# Altium project Shuttler_AMC.PrjPcb (part 18 of 20)

## Sheet FPGA_Decoupling.SchDoc: =ProjectName
size 420 x 297 mm; Author: T.P.; CompanyName: WUT; DrawnBy: T.P.; Organization: WUT ISE; Address1: Warsaw Univeristy of Technology; Address2: Nowowiejska 15/19; DocumentNumber: 12; Revision: 0.9; SheetNumber: 12; SheetTotal: 36; EDA_Number: ARTIQ; Projet: ARTIQ/SINARA; ModifiedBy: -; CreateDate: XX/XX/XXXX; CheckedDate: -; Title2: FPGA_Decoupling.SchDoc; DivGrp: ISE; Designer: G.K. and T.P.; ModifiedDate: -; ProjectName: ADC/DAC MEZZANINE
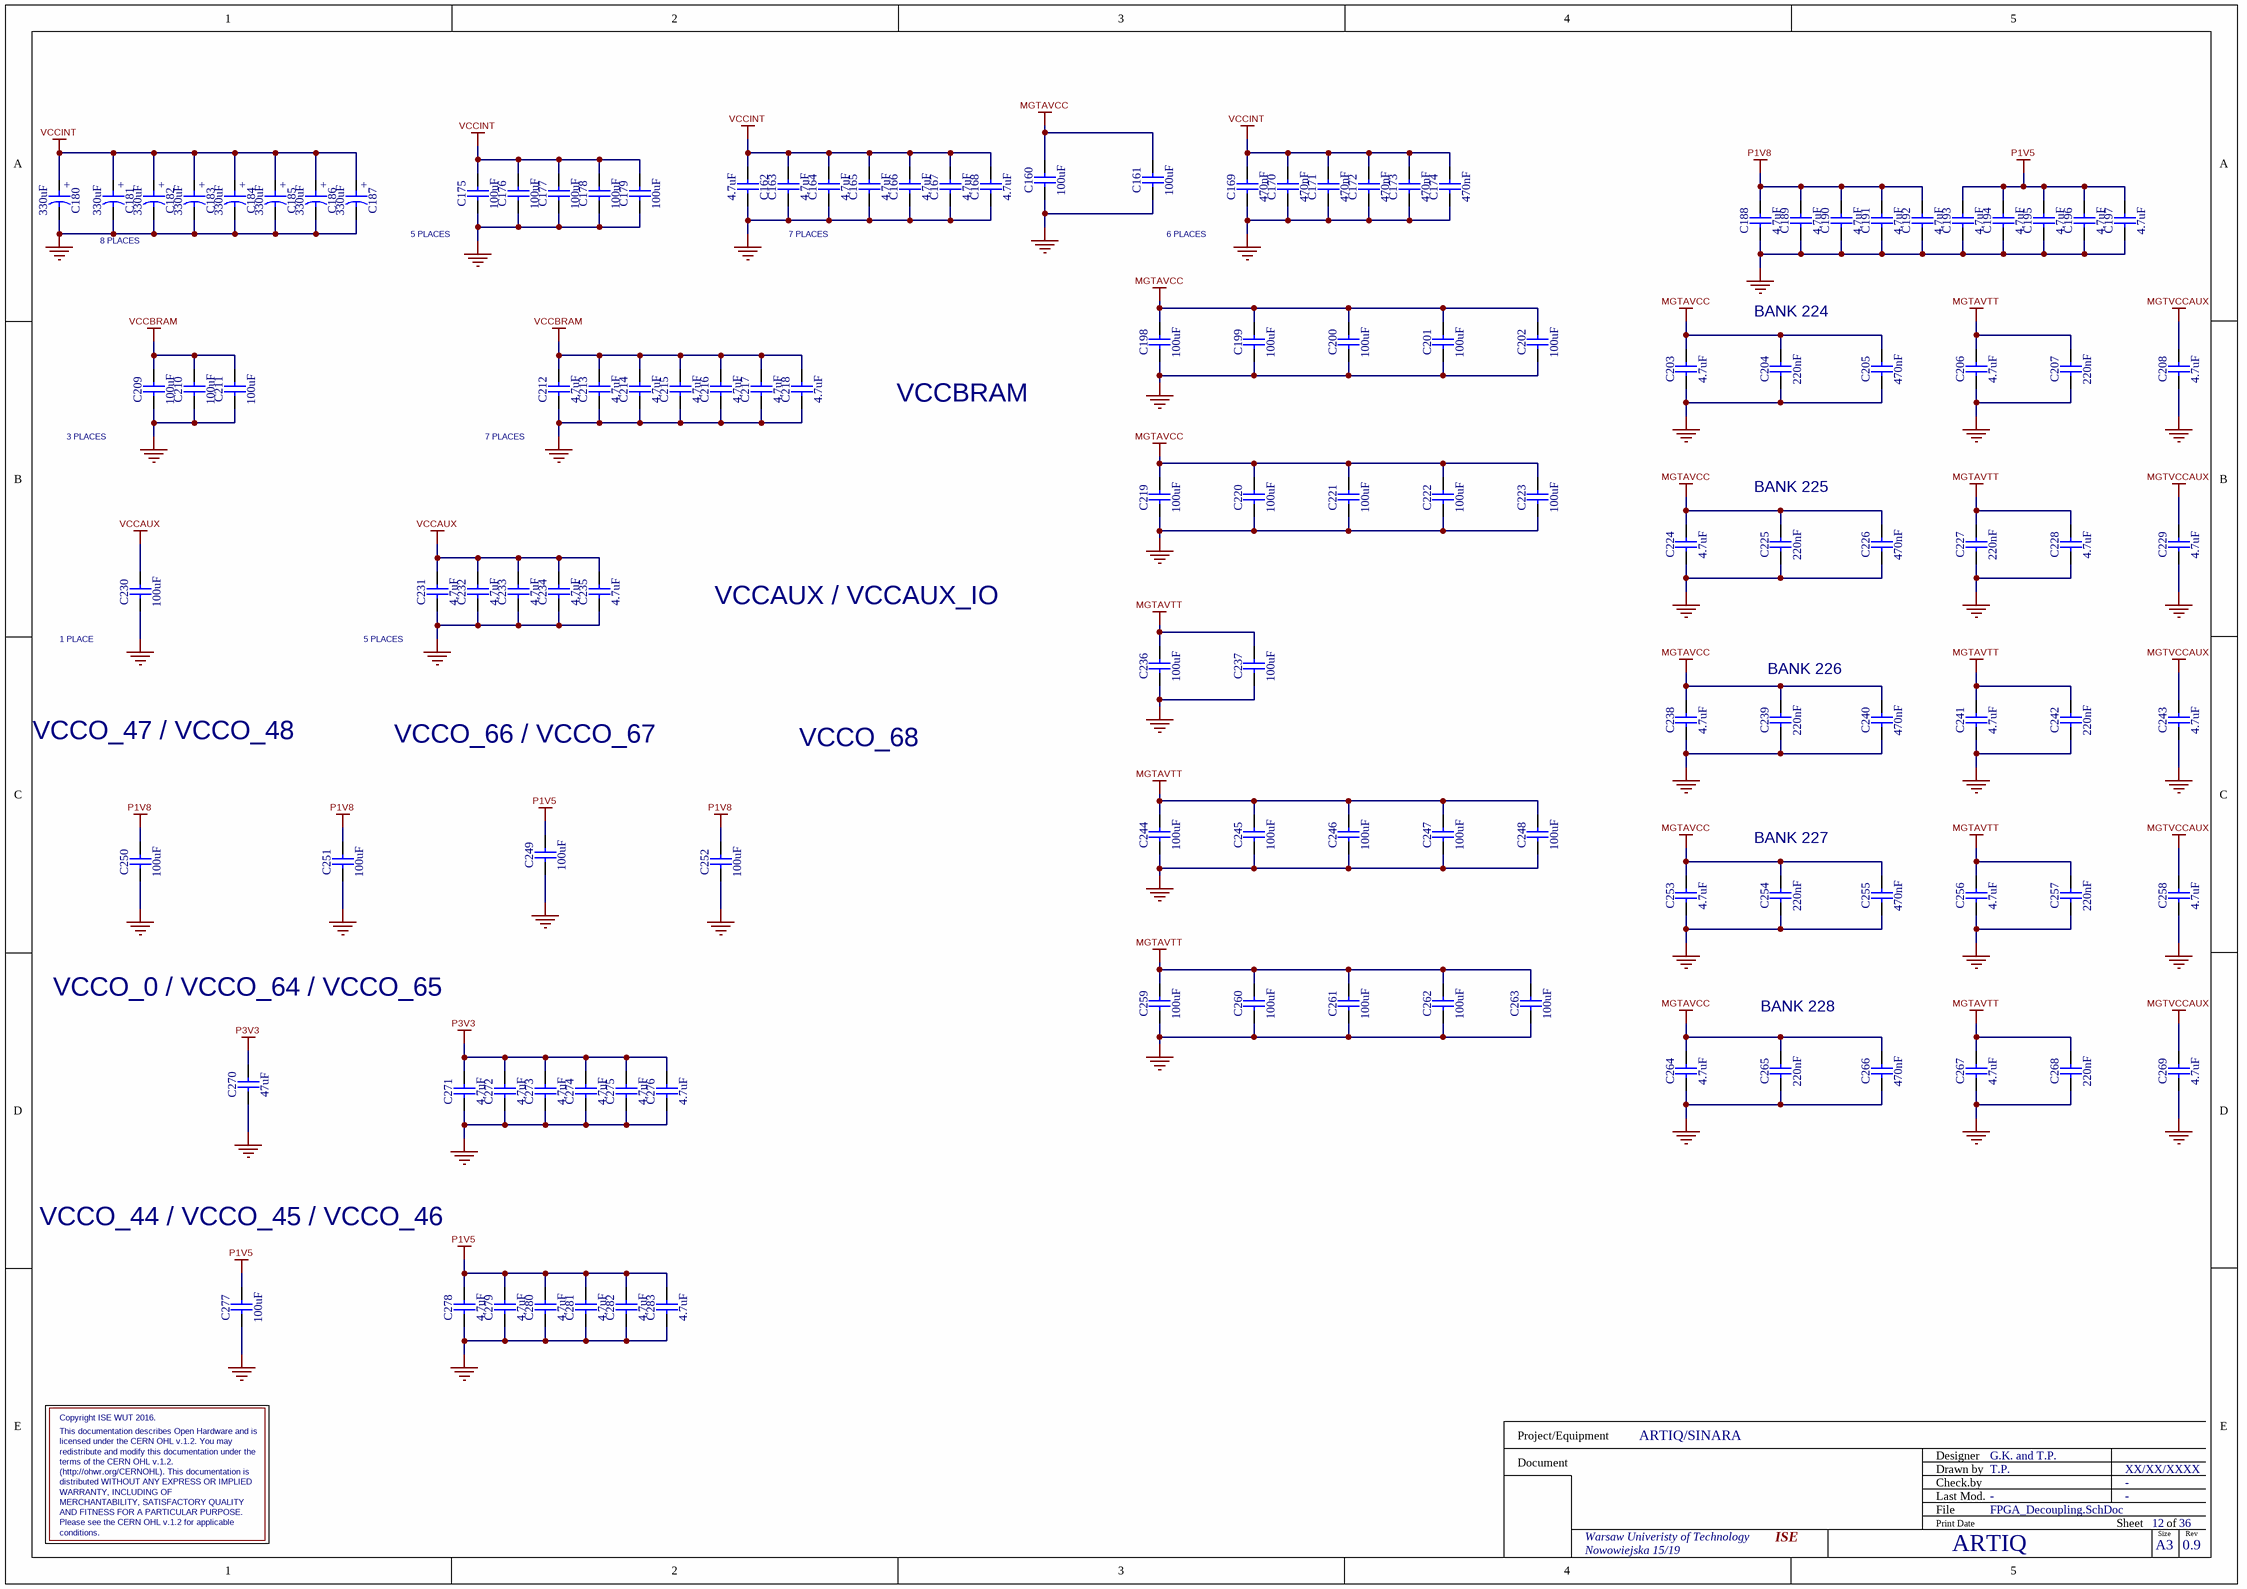
[diagram p36: FPGA_Decoupling.SchDoc]

### Parts
C160  100uF  [CAPC3216X180N]
C161  100uF  [CAPC3216X180N]
C162  4.7uF  [CAPC1005X55N]
C163  4.7uF  [CAPC1005X55N]
C164  4.7uF  [CAPC1005X55N]
C165  4.7uF  [CAPC1005X55N]
C166  4.7uF  [CAPC1005X55N]
C167  4.7uF  [CAPC1005X55N]
C168  4.7uF  [CAPC1005X55N]
C169  470nF  [CAPC0603X33N]
C170  470nF  [CAPC0603X33N]
C171  470nF  [CAPC0603X33N]
C172  470nF  [CAPC0603X33N]
C173  470nF  [CAPC0603X33N]
C174  470nF  [CAPC0603X33N]
C175  100uF  [CAPC3216X180N]
C176  100uF  [CAPC3216X180N]
C177  100uF  [CAPC3216X180N]
C178  100uF  [CAPC3216X180N]
C179  100uF  [CAPC3216X180N]
C180  330uF  [CAPMP3528X210N]
C181  330uF  [CAPMP3528X210N]
C182  330uF  [CAPMP3528X210N]
C183  330uF  [CAPMP3528X210N]
C184  330uF  [CAPMP3528X210N]
C185  330uF  [CAPMP3528X210N]
C186  330uF  [CAPMP3528X210N]
C187  330uF  [CAPMP3528X210N]
C188  4.7uF  [CAPC1005X55N]
C189  4.7uF  [CAPC1005X55N]
C190  4.7uF  [CAPC1005X55N]
C191  4.7uF  [CAPC1005X55N]
C192  4.7uF  [CAPC1005X55N]
C193  4.7uF  [CAPC1005X55N]
C194  4.7uF  [CAPC1005X55N]
C195  4.7uF  [CAPC1005X55N]
C196  4.7uF  [CAPC1005X55N]
C197  4.7uF  [CAPC1005X55N]
C198  100uF  [CAPC3216X180N]
C199  100uF  [CAPC3216X180N]
C200  100uF  [CAPC3216X180N]
C201  100uF  [CAPC3216X180N]
C202  100uF  [CAPC3216X180N]
C203  4.7uF  [CAPC1005X55N]
C204  220nF  [CAPC0603X33N]
C205  470nF  [CAPC0603X33N]
C206  4.7uF  [CAPC1005X55N]
C207  220nF  [CAPC0603X33N]
C208  4.7uF  [CAPC1005X55N]
C209  100uF  [CAPC3216X180N]
C210  100uF  [CAPC3216X180N]
C211  100uF  [CAPC3216X180N]
C212  4.7uF  [CAPC1005X55N]
C213  4.7uF  [CAPC1005X55N]
C214  4.7uF  [CAPC1005X55N]
C215  4.7uF  [CAPC1005X55N]
C216  4.7uF  [CAPC1005X55N]
C217  4.7uF  [CAPC1005X55N]
C218  4.7uF  [CAPC1005X55N]
C219  100uF  [CAPC3216X180N]
C220  100uF  [CAPC3216X180N]
C221  100uF  [CAPC3216X180N]
C222  100uF  [CAPC3216X180N]
C223  100uF  [CAPC3216X180N]
C224  4.7uF  [CAPC1005X55N]
C225  220nF  [CAPC0603X33N]
C226  470nF  [CAPC0603X33N]
C227  220nF  [CAPC0603X33N]
C228  4.7uF  [CAPC1005X55N]
C229  4.7uF  [CAPC1005X55N]
C230  100uF  [CAPC3216X180N]
C231  4.7uF  [CAPC1005X55N]
C232  4.7uF  [CAPC1005X55N]
C233  4.7uF  [CAPC1005X55N]
C234  4.7uF  [CAPC1005X55N]
C235  4.7uF  [CAPC1005X55N]
C236  100uF  [CAPC3216X180N]
C237  100uF  [CAPC3216X180N]
C238  4.7uF  [CAPC1005X55N]
C239  220nF  [CAPC0603X33N]
C240  470nF  [CAPC0603X33N]
C241  4.7uF  [CAPC1005X55N]
C242  220nF  [CAPC0603X33N]
C243  4.7uF  [CAPC1005X55N]
C244  100uF  [CAPC3216X180N]
C245  100uF  [CAPC3216X180N]
C246  100uF  [CAPC3216X180N]
C247  100uF  [CAPC3216X180N]
C248  100uF  [CAPC3216X180N]
C249  100uF  [CAPC3216X180N]
C250  100uF  [CAPC3216X180N]
C251  100uF  [CAPC3216X180N]
C252  100uF  [CAPC3216X180N]
C253  4.7uF  [CAPC1005X55N]
C254  220nF  [CAPC0603X33N]
C255  470nF  [CAPC0603X33N]
C256  4.7uF  [CAPC1005X55N]
C257  220nF  [CAPC0603X33N]
C258  4.7uF  [CAPC1005X55N]
C259  100uF  [CAPC3216X180N]
C260  100uF  [CAPC3216X180N]
C261  100uF  [CAPC3216X180N]
C262  100uF  [CAPC3216X180N]
C263  100uF  [CAPC3216X180N]
C264  4.7uF  [CAPC1005X55N]
C265  220nF  [CAPC0603X33N]
C266  470nF  [CAPC0603X33N]
C267  4.7uF  [CAPC1005X55N]
C268  220nF  [CAPC0603X33N]
C269  4.7uF  [CAPC1005X55N]
C270  47uF  [CAPC3225X270N]
C271  4.7uF  [CAPC1005X55N]
C272  4.7uF  [CAPC1005X55N]
C273  4.7uF  [CAPC1005X55N]
C274  4.7uF  [CAPC1005X55N]
C275  4.7uF  [CAPC1005X55N]
C276  4.7uF  [CAPC1005X55N]
C277  100uF  [CAPC3216X180N]
C278  4.7uF  [CAPC1005X55N]
C279  4.7uF  [CAPC1005X55N]
C280  4.7uF  [CAPC1005X55N]
C281  4.7uF  [CAPC1005X55N]
C282  4.7uF  [CAPC1005X55N]
C283  4.7uF  [CAPC1005X55N]

### Nets
GND: C160.1 C161.1 C162.1 C163.1 C164.1 C165.1 C166.1 C167.1 C168.1 C169.1 C170.1 C171.1 C172.1 C173.1 C174.1 C175.1 C176.1 C177.1 C178.1 C179.1 C180.2 C181.2 C182.2 C183.2 C184.2 C185.2 C186.2 C187.2 C188.1 C189.1 C190.1 C191.1 C192.1 C193.1 C194.1 C195.1 C196.1 C197.1 C198.1 C199.1 C200.1 C201.1 C202.1 C203.1 C204.1 C205.1 C206.1 C207.1 C208.1 C209.1 C210.1 C211.1 C212.1 C213.1 C214.1 C215.1 C216.1 C217.1 C218.1 C219.1 C220.1 C221.1 C222.1 C223.1 C224.1 C225.1 C226.1 C227.1 C228.1 C229.1 C230.1 C231.1 C232.1 C233.1 C234.1 C235.1 C236.1 C237.1 C238.1 C239.1 C240.1 C241.1 C242.1 C243.1 C244.1 C245.1 C246.1 C247.1 C248.1 C249.1 C250.1 C251.1 C252.1 C253.1 C254.1 C255.1 C256.1 C257.1 C258.1 C259.1 C260.1 C261.1 C262.1 C263.1 C264.1 C265.1 C266.1 C267.1 C268.1 C269.1 C270.1 C271.1 C272.1 C273.1 C274.1 C275.1 C276.1 C277.1 C278.1 C279.1 C280.1 C281.1 C282.1 C283.1
MGTAVCC: C160.2 C161.2 C198.2 C199.2 C200.2 C201.2 C202.2 C203.2 C204.2 C205.2 C219.2 C220.2 C221.2 C222.2 C223.2 C224.2 C225.2 C226.2 C238.2 C239.2 C240.2 C253.2 C254.2 C255.2 C264.2 C265.2 C266.2
MGTAVTT: C206.2 C207.2 C227.2 C228.2 C236.2 C237.2 C241.2 C242.2 C244.2 C245.2 C246.2 C247.2 C248.2 C256.2 C257.2 C259.2 C260.2 C261.2 C262.2 C263.2 C267.2 C268.2
MGTVCCAUX: C208.2 C229.2 C243.2 C258.2 C269.2
P1V5: C193.2 C194.2 C195.2 C196.2 C197.2 C249.2 C277.2 C278.2 C279.2 C280.2 C281.2 C282.2 C283.2
P1V8: C188.2 C189.2 C190.2 C191.2 C192.2 C250.2 C251.2 C252.2
P3V3: C270.2 C271.2 C272.2 C273.2 C274.2 C275.2 C276.2
VCCAUX: C230.2 C231.2 C232.2 C233.2 C234.2 C235.2
VCCBRAM: C209.2 C210.2 C211.2 C212.2 C213.2 C214.2 C215.2 C216.2 C217.2 C218.2
VCCINT: C162.2 C163.2 C164.2 C165.2 C166.2 C167.2 C168.2 C169.2 C170.2 C171.2 C172.2 C173.2 C174.2 C175.2 C176.2 C177.2 C178.2 C179.2 C180.1 C181.1 C182.1 C183.1 C184.1 C185.1 C186.1 C187.1

### Notes on the sheet
- 8 PLACES
- 5 PLACES
- 7 PLACES
- 6 PLACES
- (near C204) BANK 224
- 3 PLACES
- VCCBRAM
- (near C225) BANK 225
- 1 PLACE
- VCCAUX / VCCAUX_IO
- (near C239) BANK 226
- VCCO_47 / VCCO_48
- VCCO_66 / VCCO_67
- VCCO_68
- (near C254) BANK 227
- VCCO_0 / VCCO_64 / VCCO_65
- (near C265) BANK 228
- VCCO_44 / VCCO_45 / VCCO_46
- Copyright ISE WUT 2016.
- terms of the CERN OHL v.1.2.
- (http://ohwr.org/CERNOHL). This documentation is
- licensed under the CERN OHL v.1.2. You may
- redistribute and modify this documentation under the
- This documentation describes Open Hardware and is
- distributed WITHOUT ANY EXPRESS OR IMPLIED
- conditions.
- AND FITNESS FOR A PARTICULAR PURPOSE.
- Please see the CERN OHL v.1.2 for applicable
- WARRANTY, INCLUDING OF
- MERCHANTABILITY, SATISFACTORY QUALITY
- Project/Equipment
- Document
- Designer
- Drawn by
- Check.by
- File
- Last Mod.
- Print Date
- Sheet
- Size
- A3
- of
- Rev
- (in symbol CTE3528-21_330UF_2.5V_20%_LESR0015_KEMET_T520) +

### Library data of the parts
C160 C161 C175-C179 C198-C202 C209-C211 C219-C223 C230 C236 C237 C244-C252 C259-C263 C277 = CC1206_100UF_6.3V_20%_X5R: Non-polarised capacitor; Manufacturer: GENERIC; Part Description: SMD Multilayer Chip Ceramic Capacitor; Manufacturer1 Part Number: C1206C107M9PACTU; Tolerance: ±10%; Voltage: 6.3V; TC: X5R; Manufacturer Part Number: CC1206_100UF_6.3V_20%_X5R; Part Number: CC1206_100UF_6.3V_20%_X5R; Value: 100uF; Component Kind: Standard; Component Type: Standard; Pin Count: 2; Status: None; Case: 1206; Mounted: Yes; Socket: No; SMD: Yes; Sense: No; Manufacturer1 Example: KEMET; Manufacturer1 ComponentHeight: 1.8mm; HelpURL: \\cern.ch\dfs\Applications\Altium\Datasheets\CC1206_X5R_KEMET.pdf; Author: CERN DEM JLC; CreateDate: 26.09.2012; LatestRevisionDate: 26.09.2012
C162-C168 C188-C197 C203 C206 C208 C212-C218 C224 C228 C229 C231-C235 C238 C241 C243 C253 C256 C258 C264 C267 C269 C271-C276 C278-C283 = CC0402_4.7UF_6.3V_20%_X5R: Non-polarised capacitor; Manufacturer: GENERIC; Part Description: SMD Multilayer Chip Ceramic Capacitor; Manufacturer1 Part Number: C1005X5R0J475M050BC; Tolerance: ±20%; Voltage: 6.3V; TC: X5R; Manufacturer Part Number: CC0402_4.7UF_6.3V_20%_X5R; Part Number: CC0402_4.7UF_6.3V_20%_X5R; Value: 4.7uF; Component Kind: Standard; Component Type: Standard; Pin Count: 2; Status: Preferred; Case: 0402; Mounted: Yes; Socket: No; SMD: Yes; Sense: No; Manufacturer1 Example: TDK; Manufacturer1 ComponentHeight: 0.65mm; HelpURL: \\cern.ch\dfs\Applications\Altium\Datasheets\CC0402_X5R_TDK_C.pdf; Author: CERN DEM JLC; CreateDate: 03.03.2015; LatestRevisionDate: 03.03.2015
C169-C174 C205 C226 C240 C255 C266 = CC0201_470NF_4V_20%_X5R: Non-polarised capacitor; Manufacturer: GENERIC; Part Description: SMD Multilayer Chip Ceramic Capacitor; Manufacturer1 Part Number: AMK063BJ474MP-F; Tolerance: ±20%; Voltage: 4V; TC: X5R; Manufacturer Part Number: CC0201_470NF_4V_20%_X5R; Part Number: CC0201_470NF_4V_20%_X5R; Value: 470nF; Component Kind: Standard; Component Type: Standard; Pin Count: 2; Status: Not Recommended; Case: 0201; Mounted: Yes; Socket: No; SMD: Yes; Sense: No; Manufacturer1 Example: TAIYO YUDEN; Manufacturer1 ComponentHeight: 0.33mm; HelpURL: \\cern.ch\dfs\Applications\Altium\Datasheets\CC0201_X5R_TAIYO-YUDEN_STANDARD-CLASS2.pdf; Author: CERN DEM JLC; CreateDate: 27.05.2010; LatestRevisionDate: 27.05.2010
C180-C187 = CTE3528-21_330UF_2.5V_20%_LESR0015_KEMET_T520: Polarised capacitor; Manufacturer Part Number: T520B337M2R5ATE015; Manufacturer: KEMET; Part Description: Low ESR 0R015 Tantalum Chip Capacitor; Tolerance: ±20%; Voltage: 2.5V; Part Number: CTE3528-21_330UF_2.5V_20%_LESR0015_KEMET_T520; Value: 330uF; Component Kind: Standard; Component Type: Standard; Pin Count: 2; Status: None; Case: B; Mounted: Yes; Socket: No; SMD: Yes; Sense: No; ComponentHeight: 2.1mm; HelpURL: \\cern.ch\dfs\Applications\Altium\Datasheets\CTE-LESR_KEMET_T520.pdf; Author: CERN DEM JLC; CreateDate: 07.03.2012; LatestRevisionDate: 01.09.2014
C204 C207 C225 C227 C239 C242 C254 C257 C265 C268 = CC0201_220NF_6.3V_20%_X5R: Non-polarised capacitor; Manufacturer: GENERIC; Part Description: SMD Multilayer Chip Ceramic Capacitor; Manufacturer1 Part Number: JMK063BJ224MP-F; Tolerance: ±20%; Voltage: 6.3V; TC: X5R; Manufacturer Part Number: CC0201_220NF_6.3V_20%_X5R; Part Number: CC0201_220NF_6.3V_20%_X5R; Value: 220nF; Component Kind: Standard; Component Type: Standard; Pin Count: 2; Status: Not Recommended; Case: 0201; Mounted: Yes; Socket: No; SMD: Yes; Sense: No; Manufacturer1 Example: TAIYO YUDEN; Manufacturer1 ComponentHeight: 0.33mm; HelpURL: \\cern.ch\dfs\Applications\Altium\Datasheets\CC0201_X5R_TAIYO-YUDEN_STANDARD-CLASS2.pdf; Author: CERN DEM JLC; CreateDate: 27.05.2010; LatestRevisionDate: 27.05.2010
C270 = CC1210_47UF_6.3V_10%_X5R: Non-polarised capacitor; Manufacturer: GENERIC; Part Description: SMD Multilayer Chip Ceramic Capacitor; Manufacturer1 Part Number: 12106D476KAT2A; Tolerance: ±10%; Voltage: 6.3V; TC: X5R; Manufacturer Part Number: CC1210_47UF_6.3V_10%_X5R; Part Number: CC1210_47UF_6.3V_10%_X5R; Value: 47uF; Component Kind: Standard; Component Type: Standard; Pin Count: 2; Status: Preferred; Case: 1210; Mounted: Yes; Socket: No; SMD: Yes; Sense: No; Manufacturer1 Example: AVX; Manufacturer1 ComponentHeight: 2.79mm; HelpURL: \\cern.ch\dfs\Applications\Altium\Datasheets\CC1210_X5R_AVX.pdf; Author: CERN DEM JLC; CreateDate: 12.11.2014; LatestRevisionDate: 12.11.2014